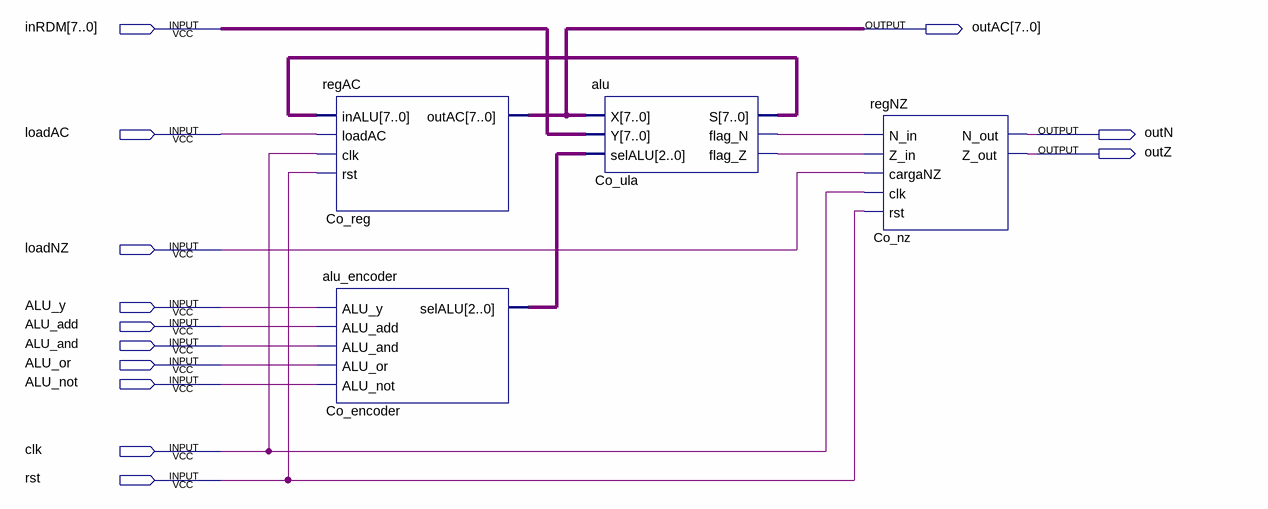
[diagram p0: schematic sheet]
// Quartus schematic mega_alu.bdf as structural Verilog: 4 symbols, 13 pins
module mega_alu (
  input  [7:0] inRDM,
  input  loadAC,
  input  loadNZ,
  input  ALU_y,
  input  ALU_add,
  input  ALU_and,
  input  ALU_or,
  input  ALU_not,
  input  clk,
  input  rst,
  output [7:0] outAC,
  output outN,
  output outZ
);

  wire Co_ula_flag_n, Co_ula_flag_z;
  wire [2:0] Co_encoder_selalu;
  wire [7:0] Co_ula_s;

  regAC Co_reg (.inALU(Co_ula_s), .loadAC(loadAC), .clk(clk), .rst(rst), .outAC(outAC));
  alu_encoder Co_encoder (
    .ALU_y(ALU_y), .ALU_add(ALU_add), .ALU_and(ALU_and), .ALU_or(ALU_or), .ALU_not(ALU_not),
    .selALU(Co_encoder_selalu));
  alu Co_ula (
    .X(outAC), .Y(inRDM), .selALU(Co_encoder_selalu), .S(Co_ula_s), .flag_N(Co_ula_flag_n),
    .flag_Z(Co_ula_flag_z));
  regNZ Co_nz (
    .N_in(Co_ula_flag_n), .Z_in(Co_ula_flag_z), .cargaNZ(loadNZ), .clk(clk), .rst(rst), .N_out(outN),
    .Z_out(outZ));
endmodule
